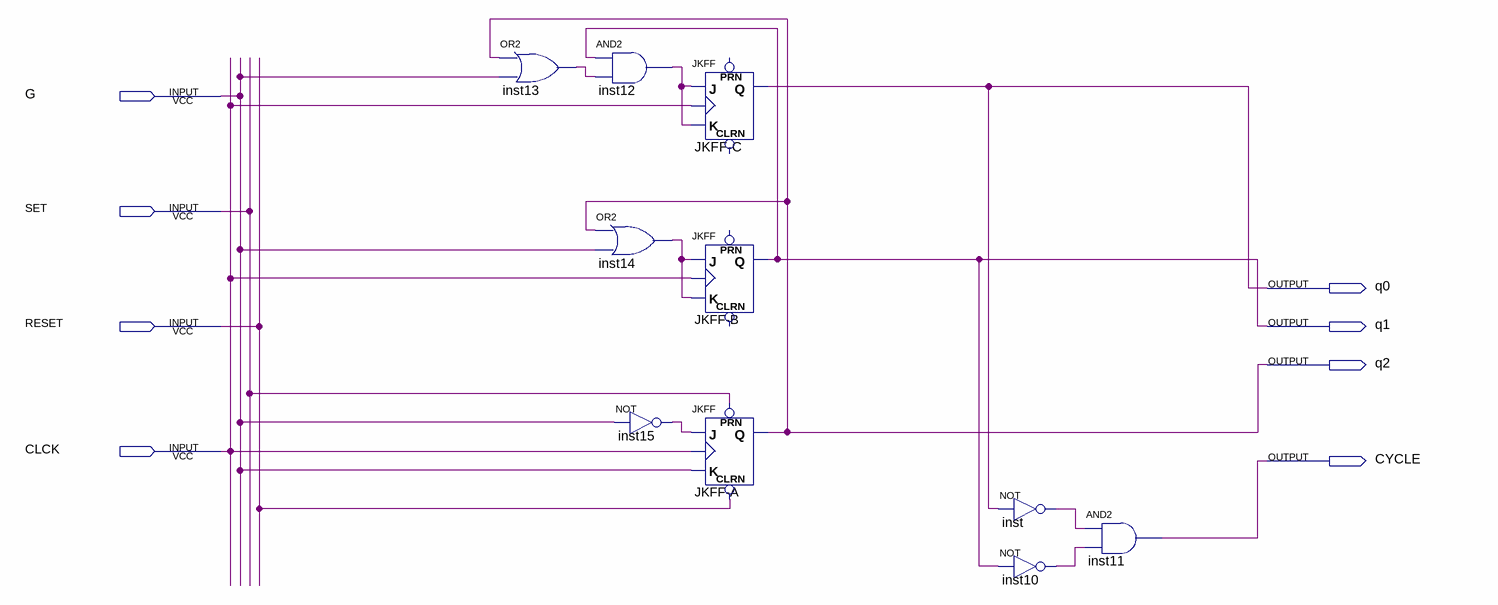
[diagram p0: schematic sheet]
// Quartus schematic Schaltkreis.bdf as structural Verilog: 10 symbols, 8 pins
module Schaltkreis (
  input  G,
  input  SET,
  input  RESET,
  input  CLCK,
  output q0,
  output q1,
  output q2,
  output CYCLE
);

  wire inst10_out, inst12_out, inst13_out, inst14_out, inst15_out, inst_out;

  or inst13 (inst13_out, q2, G);
  and inst12 (inst12_out, q1, inst13_out);
  or inst14 (inst14_out, q2, G);
  not inst15 (inst15_out, G);
  JKFF \JKFF-C  (.K(inst12_out), .J(inst12_out), .CLK(CLCK), .Q(q0));  // open: PRN, CLRN
  JKFF \JKFF-B  (.K(inst14_out), .J(inst14_out), .CLK(CLCK), .Q(q1));  // open: PRN, CLRN
  JKFF \JKFF-A  (.PRN(SET), .CLRN(RESET), .K(G), .J(inst15_out), .CLK(CLCK), .Q(q2));
  not inst (inst_out, q0);
  not inst10 (inst10_out, q1);
  and inst11 (CYCLE, inst_out, inst10_out);
endmodule
